# Altium schematic sheet hex-inverter.SchDoc
size 381 x 241 mm; SheetNumber: 1; SheetTotal: 1
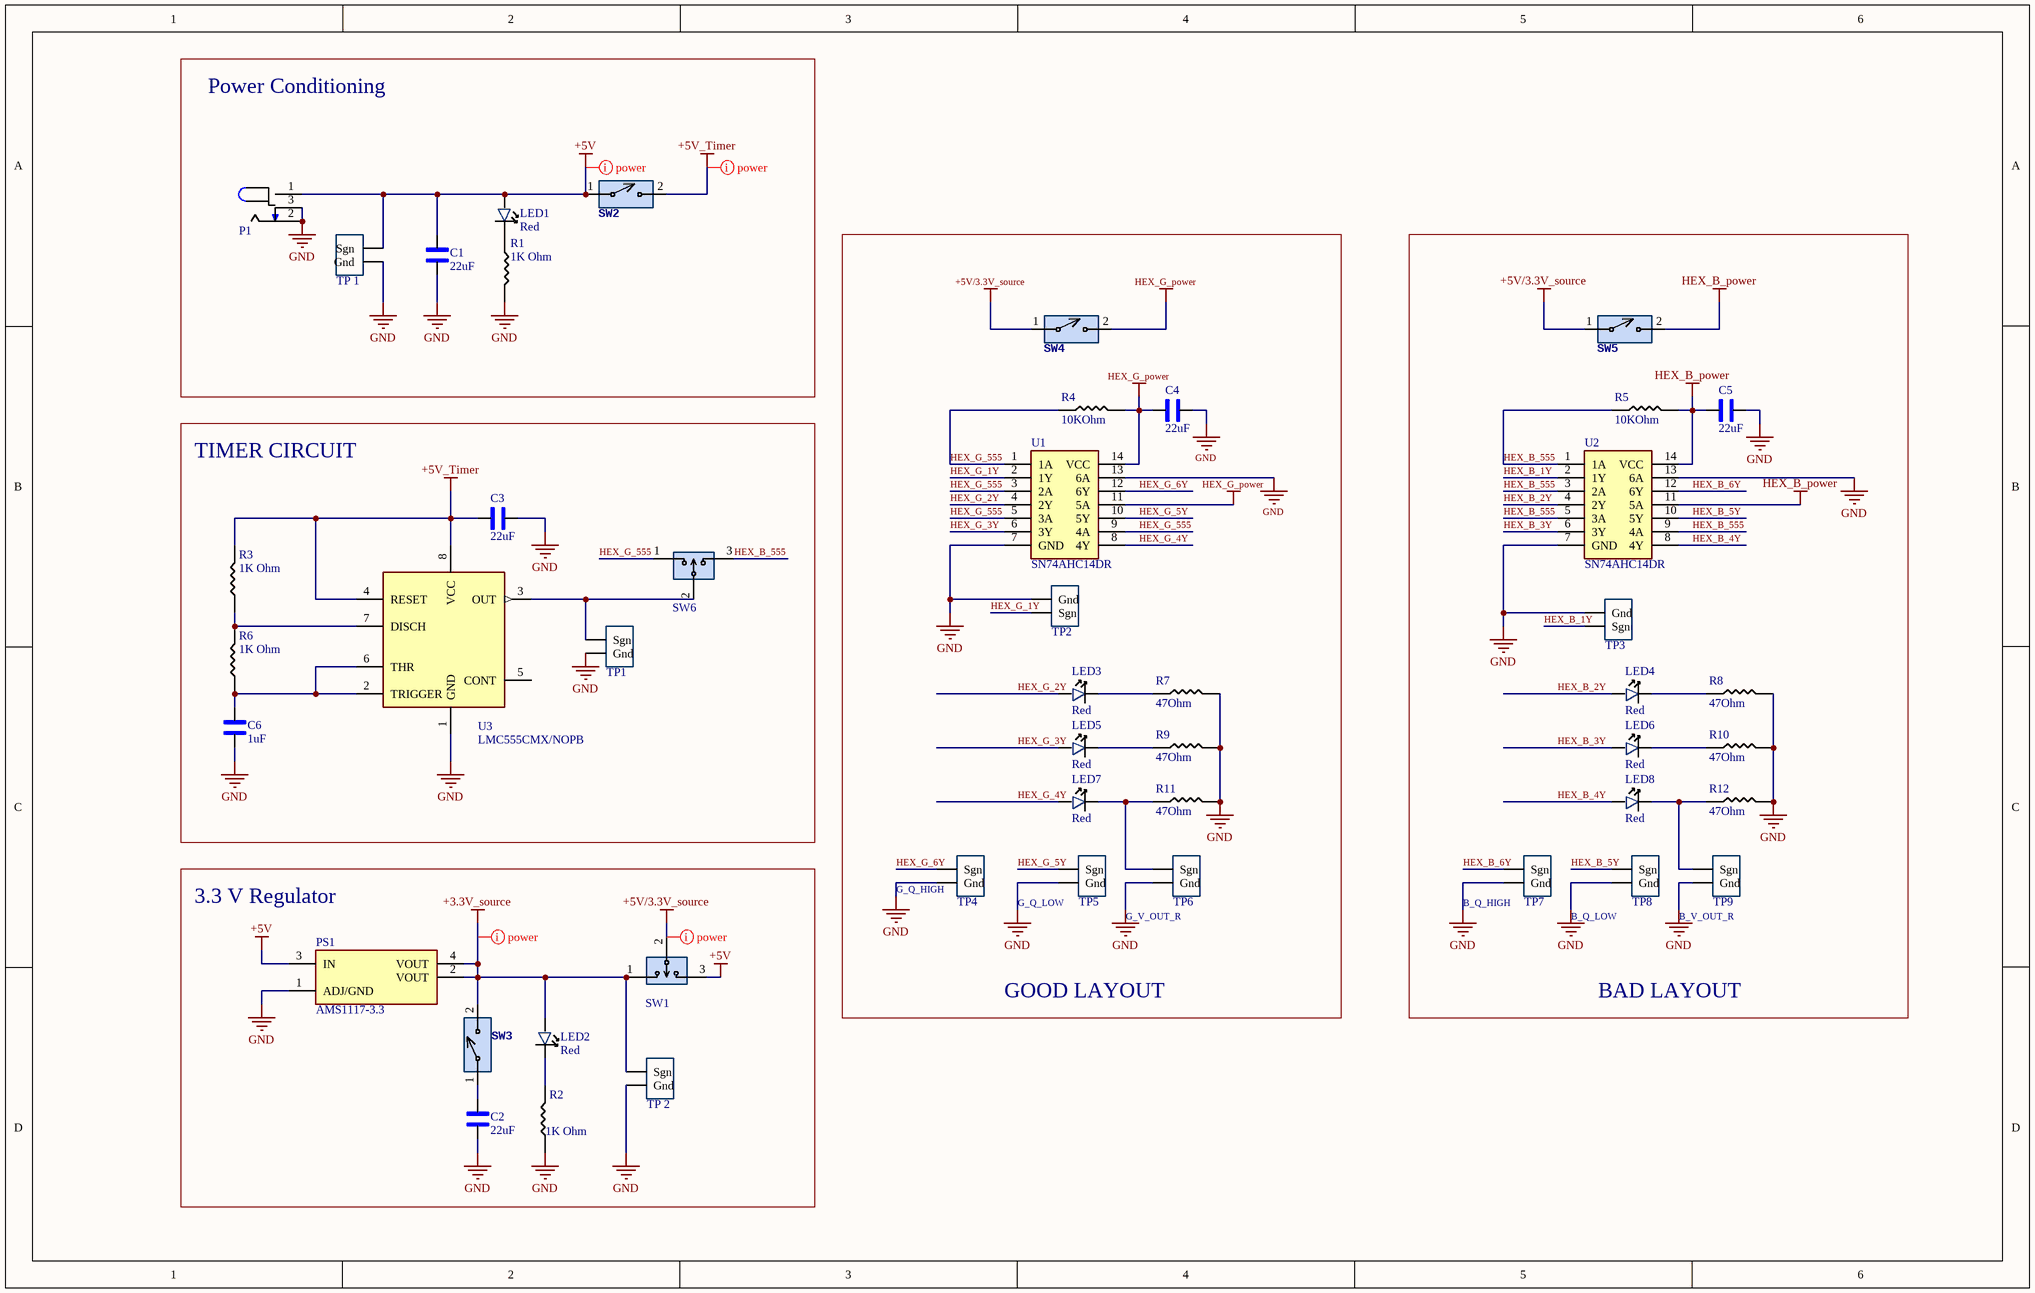
[diagram p0: hex-inverter.SchDoc]

## Parts
C1  22uF  [1206_Passive_Capacitor]
C2  22uF  [1206_Passive_Capacitor]
C3  22uF  [1206_Passive_Capacitor]
C4  22uF  [1206_Passive_Capacitor]
C5  22uF  [1206_Passive_Capacitor]
C6  1uF  [1206_Passive_Capacitor]
LED1  Red  [LED_1206]
LED2  Red  [LED_1206]
LED3  Red  [LED_1206]
LED4  Red  [LED_1206]
LED5  Red  [LED_1206]
LED6  Red  [LED_1206]
LED7  Red  [LED_1206]
LED8  Red  [LED_1206]
P1  Power Jack  [Power_Jack]  (value not drawn)
PS1  AMS1117-3.3  [LDO]
R1  value 1K Ohm  [1206_Passive_Resitor]  (hidden comment: 1k)
R2  value 1K Ohm  [1206_Passive_Resitor]  (hidden comment: 1k)
R3  value 1K Ohm  [1206_Passive_Resitor]  (hidden comment: 1k)
R4  value 10KOhm  [1206_Passive_Resitor]  (hidden comment: 10k)
R5  value 10KOhm  [1206_Passive_Resitor]  (hidden comment: 10k)
R6  value 1K Ohm  [1206_Passive_Resitor]  (hidden comment: 1k)
R7  value 47Ohm  [1206_Passive_Resitor]  (hidden comment: 47 Ohms)
R8  value 47Ohm  [1206_Passive_Resitor]  (hidden comment: 47 Ohms)
R9  value 47Ohm  [1206_Passive_Resitor]  (hidden comment: 47 Ohms)
R10  value 47Ohm  [1206_Passive_Resitor]  (hidden comment: 47 Ohms)
R11  value 47Ohm  [1206_Passive_Resitor]  (hidden comment: 47 Ohms)
R12  value 47Ohm  [1206_Passive_Resitor]  (hidden comment: 47 Ohms)
SW1  PREC003SAAN-RC  [3_PIN_100mil]  (value not drawn)
SW2  SW_2Pin_100mil_Switch  [2Pin-Header-Conn]  (value not drawn)
SW3  SW_2Pin_100mil_Switch  [2Pin-Header-Conn]  (value not drawn)
SW4  SW_2Pin_100mil_Switch  [2Pin-Header-Conn]  (value not drawn)
SW5  SW_2Pin_100mil_Switch  [2Pin-Header-Conn]  (value not drawn)
SW6  PREC003SAAN-RC  [3_PIN_100mil]  (value not drawn)
TP1  10x Probe TP  [TP10x_Probe]  (value not drawn)
TP2  10x Probe TP  [TP10x_Probe]  (value not drawn)
TP3  10x Probe TP  [TP10x_Probe]  (value not drawn)
TP4  10x Probe TP  [TP10x_Probe]  (value not drawn)
TP5  10x Probe TP  [TP10x_Probe]  (value not drawn)
TP6  10x Probe TP  [TP10x_Probe]  (value not drawn)
TP7  10x Probe TP  [TP10x_Probe]  (value not drawn)
TP8  10x Probe TP  [TP10x_Probe]  (value not drawn)
TP9  10x Probe TP  [TP10x_Probe]  (value not drawn)
TP_1  10x Probe TP  [TP10x_Probe]  (value not drawn)
TP_2  10x Probe TP  [TP10x_Probe]  (value not drawn)
U1  SN74AHC14DR  [HEX_74AC14]
U2  SN74AHC14DR  [HEX_74AC14]
U3  LMC555CMX/NOPB  [TS555IDTTR]

## Blocks framed on the sheet
Power Conditioning: C1 LED1 P1 R1 SW2 TP_1
GOOD LAYOUT: C4 LED3 LED5 LED7 R4 R7 R9 R11 SW4 TP2 TP4-TP6 U1
BAD LAYOUT: C5 LED4 LED6 LED8 R5 R8 R10 R12 SW5 TP3 TP7-TP9 U2
TIMER CIRCUIT: C3 C6 R3 R6 SW6 TP1 U3
3.3 V Regulator: C2 LED2 PS1 R2 SW1 SW3 TP_2

## Nets
+3.3V_source: LED2.1 PS1.2(VOUT) PS1.4(VOUT) SW1.1 SW3.2 TP_2.1(Sgn)
+5V: C1.2 LED1.1 P1.1 PS1.3(IN) SW1.3 SW2.1 TP_1.1(Sgn)
+5V/3.3V_source: SW1.2 SW4.1 SW5.1
+5V_Timer: C3.2 R3.2 SW2.2 U3.4(RESET) U3.8(VCC)
GND: C1.1 C2.1 C3.1 C4.1 C5.1 C6.1 P1.2 P1.3 PS1.1(ADJ/GND) R1.2 R2.1 R7.2 R8.2 R9.2 R10.2 R11.2 R12.2 TP1.2(Gnd) TP2.2(Gnd) TP3.2(Gnd) TP4.2(Gnd) TP5.2(Gnd) TP6.2(Gnd) TP7.2(Gnd) TP8.2(Gnd) TP9.2(Gnd) TP_1.2(Gnd) TP_2.2(Gnd) U1.7(GND) U1.13(6A) U2.7(GND) U2.13(6A) U3.1(GND)
HEX_B_power: C5.2 R5.2 SW5.2 U2.11(5A) U2.14(VCC)
HEX_G_power: C4.2 R4.2 SW4.2 U1.11(5A) U1.14(VCC)
HEX_B_1Y: TP3.1(Sgn) U2.2(1Y)
HEX_B_2Y: LED4.1 U2.4(2Y)
HEX_B_3Y: LED6.1 U2.6(3Y)
HEX_B_4Y: LED8.1 U2.8(4Y)
HEX_B_5Y: TP8.1(Sgn) U2.10(5Y)
HEX_B_6Y: TP7.1(Sgn) U2.12(6Y)
HEX_B_555: R5.1 SW6.3 U2.1(1A) U2.3(2A) U2.5(3A) U2.9(4A)
HEX_G_1Y: TP2.1(Sgn) U1.2(1Y)
HEX_G_2Y: LED3.1 U1.4(2Y)
HEX_G_3Y: LED5.1 U1.6(3Y)
HEX_G_4Y: LED7.1 U1.8(4Y)
HEX_G_5Y: TP5.1(Sgn) U1.10(5Y)
HEX_G_6Y: TP4.1(Sgn) U1.12(6Y)
HEX_G_555: R4.1 SW6.1 U1.1(1A) U1.3(2A) U1.5(3A) U1.9(4A)
NetC2_2: C2.2 SW3.1
NetC6_2: C6.2 R6.1 U3.2(TRIGGER) U3.6(THR)
NetLED1_2: LED1.2 R1.1
NetLED2_2: LED2.2 R2.2
NetLED3_2: LED3.2 R7.1
NetLED4_2: LED4.2 R8.1
NetLED5_2: LED5.2 R9.1
NetLED6_2: LED6.2 R10.1
NetLED7_2: LED7.2 R11.1 TP6.1(Sgn)
NetLED8_2: LED8.2 R12.1 TP9.1(Sgn)
NetR3_1: R3.1 R6.2 U3.7(DISCH)
NetSW6_2: SW6.2 TP1.1(Sgn) U3.3(OUT)

Not connected (* = marked no-connect by the designer): U3 5(CONT)

## Layout directives
rule Width Constraint [Pref Width = 20mil    Min Width = 15mil    Max Width = 20mil]: +3.3V_source, +5V, +5V/3.3V_source, +5V_Timer

## Notes on the sheet
- (near TP4) G_Q_HIGH
- (near TP5) G_Q_LOW
- (near TP7) B_Q_HIGH
- (near TP6) G_V_OUT_R
- B_Q_LOW
- (near TP9) B_V_OUT_R

## Library data of the parts
C1-C5 = C_22uF_1206: 22uF ±10% 25V X5R 1206 Multilayer Ceramic Capacitors MLCC - SMD/SMT RoHS; MFR Part #: CL31A226KAHNNNE; Type: basic; LCSC Part#: C12891; Datasheet: https://datasheet.lcsc.com/lcsc/1811031514_Samsung-Electro-Mechanics-CL31A226KAHNNNE_C12891.pdf; Value: 22uF
C6 = C_1uF_1206: MULTILAYER CERAMIC CAPACITORS MLCC - SMD/SMT 1UF 50V 1206 ROHS; MFR Part #: CL31B105KBHNNNE; Type: Basic; Digikey Link: https://www.digikey.com/product-detail/en/C1206C105M4RACTU/399-8150-1-ND/3471873/?itemSeq=304982366; LCSC Part#: C1848; Value: 1uF
LED1-LED8 = LED_RED_1206: Red 621~631nm 1206 Light Emitting Diodes (LED) RoHS; MFR Part #: 15-21/R6C-FQ1R1B/2T; Type: Extended; LCSC Part#: C93133; Datasheet: https://datasheet.lcsc.com/szlcsc/1811151241_Everlight-Elec-15-21-R6C-FQ1R1B-2T_C93133.pdf; Value: Red
P1 = P_Power Jack: Power Barrel Connector Jack 2.10mm ID (0.083"), 5.50mm OD (0.217") Through Hole, Right Angle; MFR Part #: PJ-102A; Value: CONN PWR JACK 2X5.5MM SOLDER; Digikey Link: https://www.digikey.com/product-detail/en/PJ-102A/CP-102A-ND/275425/?itemSeq=304982367; LCSC Part#: C136744; Type: Extended
PS1 = PS_AMS_LDO_3v3: LOW DROPOUT REGULATORS(LDO) POSITIVE FIXED 1.3V @ 800MA 15V 3.3V 1A SOT-223 ROHS; Value: IC REG LINEAR 3.3V 800MA SOT223; MFR Part #: AMS1117-3.3; LCSC Part#: C6186; Type: Basic
R1-R3 R6 = R_1K_1206: CHIP RESISTOR - SURFACE MOUNT 1KOHMS ±1% 1/4W 1206 ROHS; MFR Part #: RNCP1206FTD1K00CT; Digikey Link: https://www.digikey.com/product-detail/en/RNCP1206FTD1K00/RNCP1206FTD1K00CT-ND/2240675/?itemSeq=304982373; LCSC Part#: C4410; Type: Basic
R4 R5 = R_10KOhm_1206: 10 kOhms ±5% 0.25W, 1/4W Chip Resistor 1206 (3216 Metric) Automotive AEC-Q200 Thick Film; MFR Part #: RMCF1206FT10K0; Digikey Link: https://www.digikey.com/en/products/detail/stackpole-electronics-inc/RMCF1206FT10K0/1759669; LCSC Part#: C17902; Type: Basic
R7-R12 = R_47Ohm_1206: 47Ω ±5% 0.25W ±200ppm/℃ 1206 Chip Resistor - Surface Mount RoHS; MFR Part #: 1206W4J0470T5E; LCSC Part#: C25384; Type: Extended; Datasheet: https://datasheet.lcsc.com/lcsc/1811101020_UNI-ROYAL-Uniroyal-Elec-1206W4J0470T5E_C25384.pdf
SW1 SW6 = SW_3Pin_100mil_Switch: Connector Header Through Hole 3 position 0.100" (2.54mm); Value: CONN HEADER VERT 3POS 2.54MM; Digikey Link: https://www.digikey.com/product-detail/en/PREC003SAAN-RC/S1012EC-03-ND/2774851/?itemSeq=304982371; MFR Part #: PREC003SAAN-RC; Type: Extended; LCSC Part#: C49257
SW2-SW5 = SW_2Pin_100mil_Switch: 2Pin Header; LCSC Part#: C124375; Type: Extended
TP1-TP9 TP_1 TP_2 = TP_10x_Probe: Test Point 300 mil centers
U1 U2 = U_74AHC14: Inverter IC 6 Channel Schmitt Trigger 14-SOIC; Datasheet: https://datasheet.lcsc.com/szlcsc/ON-Semicon-ON-74AC14SCX_C5482.pdf; MFR Part #: SN74AHC14DR; LCSC Part#: C6942; Type: Extended
U3 = U_555_Fast: 555 Type, Timer/Oscillator _Single_ IC 3MHz 8-SO; Package: SOIC-8; MFR Part #: LMC555CMX/NOPB; DigiKey link: https://www.digikey.com/product-detail/en/texas-instruments/LMC555CMX-NOPB/LMC555CMX-NOPBCT-ND/1010550; LCSC Part#: C90760; Type: Extended